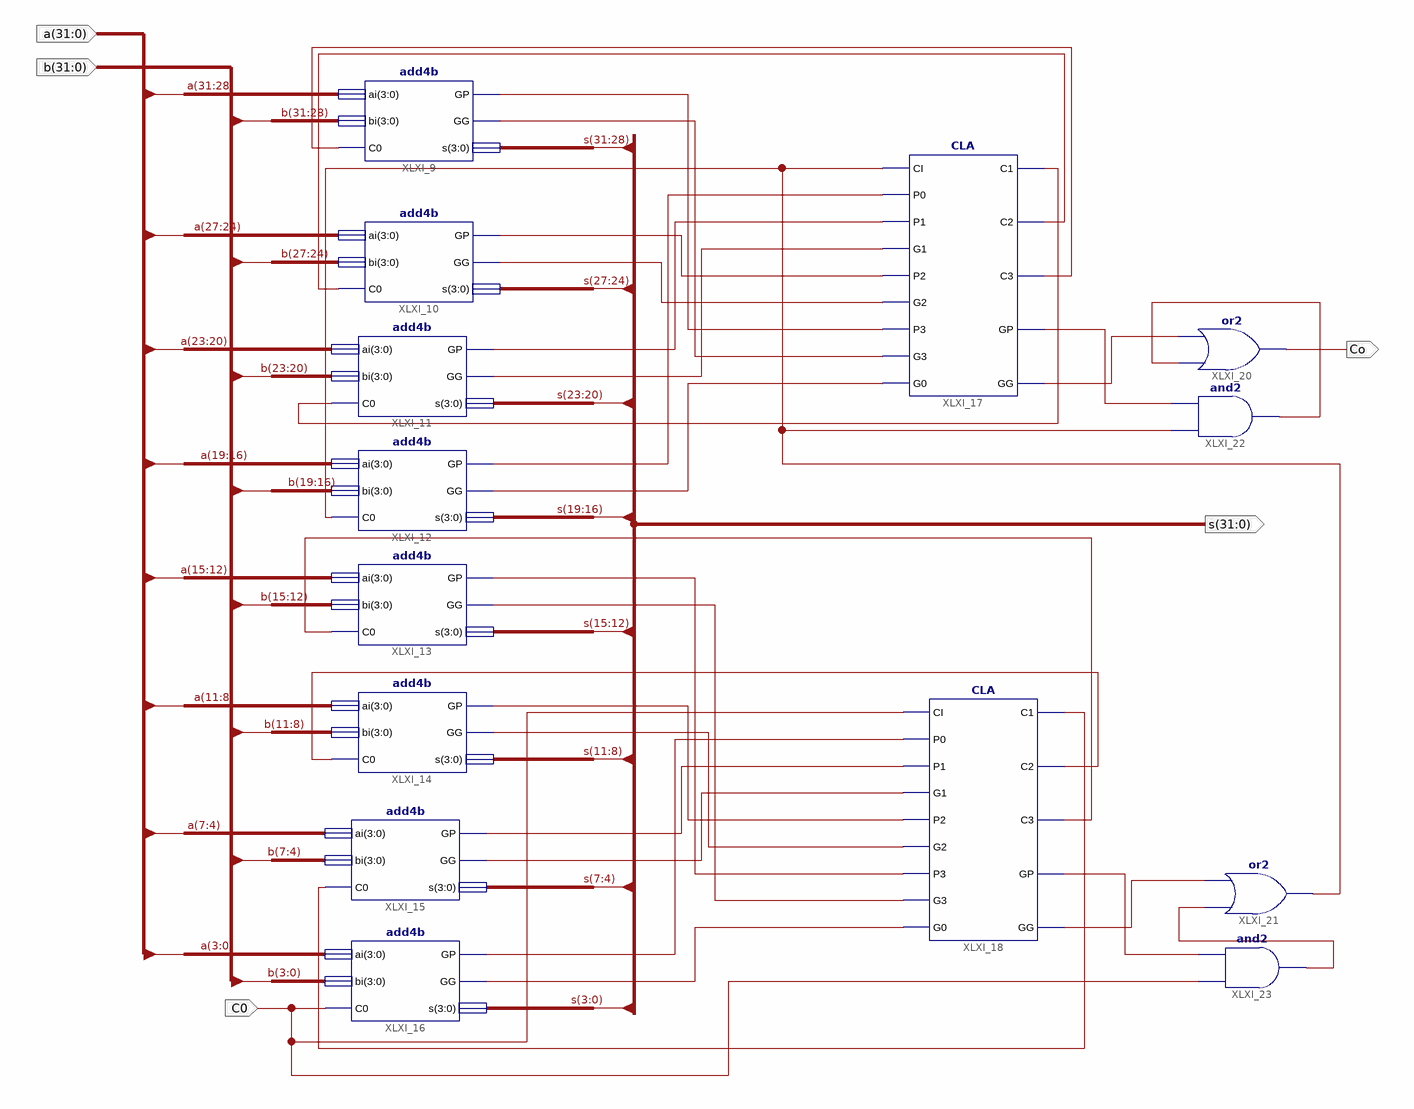
[diagram p0: schematic sheet 1]
// Xilinx ISE schematic ADC32.sch (kintex7) as structural Verilog: 14 symbols, 5 ports
module ADC32 (
  input  [31:0] a,
  input  [31:0] b,
  input  C0,
  output [31:0] s,
  output Co
);

  wire XLXN_35, XLXN_36, XLXN_37, XLXN_39, XLXN_40, XLXN_41, XLXN_42, XLXN_43, XLXN_44, XLXN_45, XLXN_46,
       XLXN_47, XLXN_48, XLXN_50, XLXN_51, XLXN_53, XLXN_54, XLXN_55, XLXN_56, XLXN_58, XLXN_59, XLXN_60,
       XLXN_61, XLXN_62, XLXN_63, XLXN_64, XLXN_65, XLXN_66, XLXN_67;

  add4b XLXI_9 (.ai(a[31:28]), .bi(b[31:28]), .C0(XLXN_35), .GG(XLXN_43), .GP(XLXN_39), .s(s[31:28]));
  add4b XLXI_10 (.ai(a[27:24]), .bi(b[27:24]), .C0(XLXN_36), .GG(XLXN_44), .GP(XLXN_40), .s(s[27:24]));
  add4b XLXI_11 (.ai(a[23:20]), .bi(b[23:20]), .C0(XLXN_37), .GG(XLXN_45), .GP(XLXN_41), .s(s[23:20]));
  add4b XLXI_12 (.ai(a[19:16]), .bi(b[19:16]), .C0(XLXN_64), .GG(XLXN_46), .GP(XLXN_42), .s(s[19:16]));
  add4b XLXI_13 (.ai(a[15:12]), .bi(b[15:12]), .C0(XLXN_47), .GG(XLXN_60), .GP(XLXN_51), .s(s[15:12]));
  add4b XLXI_14 (.ai(a[11:8]), .bi(b[11:8]), .C0(XLXN_48), .GG(XLXN_59), .GP(XLXN_53), .s(s[11:8]));
  add4b XLXI_15 (.ai(a[7:4]), .bi(b[7:4]), .C0(XLXN_50), .GG(XLXN_58), .GP(XLXN_54), .s(s[7:4]));
  add4b XLXI_16 (.ai(a[3:0]), .bi(b[3:0]), .C0(C0), .GG(XLXN_56), .GP(XLXN_55), .s(s[3:0]));
  CLA XLXI_17 (
    .CI(XLXN_64), .P0(XLXN_42), .P1(XLXN_41), .G1(XLXN_45), .P2(XLXN_40), .G2(XLXN_44), .P3(XLXN_39),
    .G3(XLXN_43), .G0(XLXN_46), .C1(XLXN_37), .C2(XLXN_36), .C3(XLXN_35), .GP(XLXN_61), .GG(XLXN_62));
  CLA XLXI_18 (
    .CI(C0), .P0(XLXN_55), .P1(XLXN_54), .G1(XLXN_58), .P2(XLXN_53), .G2(XLXN_59), .P3(XLXN_51),
    .G3(XLXN_60), .G0(XLXN_56), .C1(XLXN_50), .C2(XLXN_48), .C3(XLXN_47), .GP(XLXN_67), .GG(XLXN_66));
  or XLXI_20 (Co, XLXN_63, XLXN_62);
  or XLXI_21 (XLXN_64, XLXN_65, XLXN_66);
  and XLXI_22 (XLXN_63, XLXN_64, XLXN_61);
  and XLXI_23 (XLXN_65, C0, XLXN_67);
endmodule
